# EAGLE schematic solr (EAGLE 7.3.0)
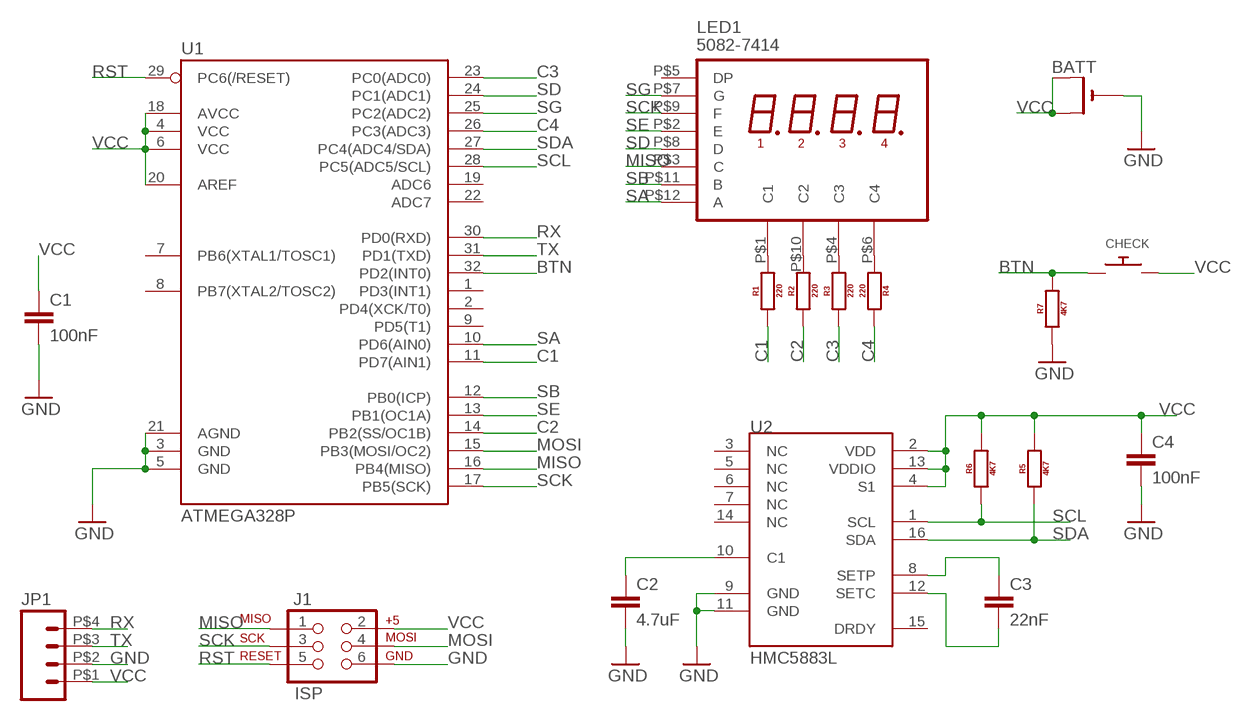
[diagram p0: schematic, sheet 1]

## Parts
BATT  CR2032SMT  [CR2032-SMD]
C1  100nF  C-EU0805  [0805]
C2  4.7uF  C-EU0805  [0805]
C3  22nF  C-EU0805  [0805]
C4  100nF  C-EU0805  [0805]
CHECK  SWITCH_PUSHBUTTONC&K_KSS  [BTN_CK_KSS]
J1  ISP  AVR_SPIEDGE  [2X3EDGE]
JP1  M04SMD_ROUND_PADS  [1X04_SMD_ROUND_PADS]
LED1  5082-7414  [5082-7414]
R1  220  RESISTOR0805  [0805]
R2  220  RESISTOR0805  [0805]
R3  220  RESISTOR0805  [0805]
R4  220  RESISTOR0805  [0805]
R5  4K7  RESISTOR0805  [0805]
R6  4K7  RESISTOR0805  [0805]
R7  4K7  RESISTOR0805  [0805]
U1  ATMEGA328P  ATMEGA328P_TQFP  [TQFP32-08]
U2  HMC5883L  HMC5883LSMD  [16LPCC]
U$1  M3_WELDING_NUTFLAT  [M3_WELDING_NUT_FLAT]  (not placed on a sheet)
U$2  M3_WELDING_NUTSTAND  [M3_WELDING_NUT_STAND]  (not placed on a sheet)

## Nets
BTN: CHECK.P$1 R7.2 U1.32(PD2(INT0))
C1: R1.1 U1.11(PD7(AIN1))
C2: R2.1 U1.14(PB2(SS/OC1B))
C3: R3.1 U1.23(PC0(ADC0))
C4: R4.2 U1.26(PC3(ADC3))
GND: BATT.- C1.2 C2.2 C4.2 J1.6 JP1.P$2 R7.1 U1.3(GND) U1.5(GND) U1.21(AGND) U2.9(GND) U2.11(GND)
MISO: J1.1 LED1.P$3(C) U1.16(PB4(MISO))
MOSI: J1.4 U1.15(PB3(MOSI/OC2))
N$1: LED1.P$1(C1) R1.2
N$2: C3.1 U2.8(SETP)
N$3: LED1.P$10(C2) R2.2
N$4: LED1.P$4(C3) R3.2
N$5: LED1.P$6(C4) R4.1
N$8: C3.2 U2.12(SETC)
N$9: C2.1 U2.10(C1)
RST: J1.5 U1.29(PC6(/RESET))
RX: JP1.P$4 U1.30(PD0(RXD))
SA: LED1.P$12(A) U1.10(PD6(AIN0))
SB: LED1.P$11(B) U1.12(PB0(ICP))
SCK: J1.3 LED1.P$9(F) U1.17(PB5(SCK))
SCL: R6.1 U1.28(PC5(ADC5/SCL)) U2.1(SCL)
SD: LED1.P$8(D) U1.24(PC1(ADC1))
SDA: R5.1 U1.27(PC4(ADC4/SDA)) U2.16(SDA)
SE: LED1.P$2(E) U1.13(PB1(OC1A))
SG: LED1.P$7(G) U1.25(PC2(ADC2))
TX: JP1.P$3 U1.31(PD1(TXD))
VCC: BATT.+$1(+) BATT.+$2(+1) C1.1 C4.1 CHECK.P$2 J1.2 JP1.P$1 R5.2 R6.2 U1.4(VCC) U1.6(VCC) U1.18(AVCC) U1.20(AREF) U2.2(VDD) U2.4(S1) U2.13(VDDIO)
Unconnected: LED1.P$5(DP) U1.1(PD3(INT1)) U1.2(PD4(XCK/T0)) U1.7(PB6(XTAL1/TOSC1)) U1.8(PB7(XTAL2/TOSC2)) U1.9(PD5(T1)) U1.19(ADC6) U1.22(ADC7) U2.3(NC) U2.5(NC) U2.6(NC) U2.7(NC) U2.14(NC) U2.15(DRDY)

## Library data of the parts
BATT = xose:CR2032
C1-C4 = xose:C-EU: CAPACITOR, European symbol
CHECK = adafruit:SWITCH_PUSHBUTTON: Buttons SOFTTOUCHSMD_SJ - Soft touch temporary push button (Super Junk Akihabara) Compatible with SKPMANE010 [Mouser: 688-SKPMAN] C&K_KSS = Digikey: KSS221GLFS
J1 = xose:AVR_SPI: AVR ISP 6 Pin This is the reduced ISP connector for AVR programming. Common on Arduino. This footprint will take up less PCB space and can be used with a 10-pin to 6-pin adapter such as SKU: BOB-08508
JP1 = xose:M04: Header 4 Standard 4-pin 0.1" header. Use with straight break away headers (SKU : PRT-00116), right angle break away headers (PRT-00553), swiss pins (PRT-00743), machine pins (PRT-00117), and female headers (PRT-00115). Molex polarized connector foot print use with SKU : PRT-08231 with associated crimp pins and housings. 1MM SMD Version SKU: PRT-10208
LED1 = xose:5082-7414: 4 digits X 7-segment + DP LED display
R1-R7 = xose:RESISTOR: Generic EU resistor symbol
U1 = xose:ATMEGA328P_TQFP; PROD_ID: IC-09069; VALUE: ATMEGA328P_TQFP
U2 = xose:HMC5883L: 3 Axis Digital Compass IC; PROD_ID: IC-10284
U$1 U$2 = xose:M3_WELDING_NUT